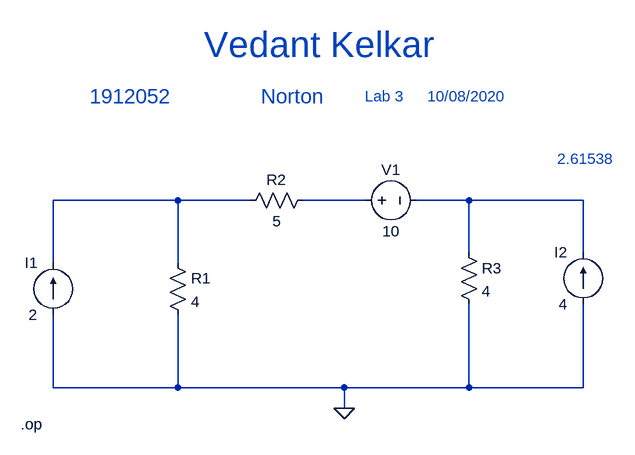
[diagram p0: schematic Draft6.asc]
Draft6.asc, the LTspice schematic file:
Version 4
SHEET 1 880 680
WIRE 96 -112 -96 -112
WIRE 208 -112 96 -112
WIRE 384 -112 288 -112
WIRE 544 -112 464 -112
WIRE 720 -112 544 -112
WIRE 544 -32 544 -112
WIRE 720 -32 720 -112
WIRE -96 -16 -96 -112
WIRE 96 -16 96 -112
WIRE -96 176 -96 64
WIRE 96 176 96 64
WIRE 96 176 -96 176
WIRE 352 176 96 176
WIRE 544 176 544 48
WIRE 544 176 352 176
WIRE 720 176 720 48
WIRE 720 176 544 176
WIRE 352 208 352 176
FLAG 352 208 0
SYMBOL current -96 64 R180
WINDOW 0 24 80 Left 2
WINDOW 3 24 0 Left 2
WINDOW 123 0 0 Left 0
WINDOW 39 0 0 Left 0
SYMATTR InstName I1
SYMATTR Value 2
SYMBOL res 80 -32 R0
SYMATTR InstName R1
SYMATTR Value 4
SYMBOL res 304 -128 R90
WINDOW 0 0 56 VBottom 2
WINDOW 3 32 56 VTop 2
SYMATTR InstName R2
SYMATTR Value 5
SYMBOL voltage 368 -112 R270
WINDOW 0 32 56 VTop 2
WINDOW 3 -32 56 VBottom 2
WINDOW 123 0 0 Left 0
WINDOW 39 0 0 Left 0
SYMATTR InstName V1
SYMATTR Value 10
SYMBOL res 528 -48 R0
SYMATTR InstName R3
SYMATTR Value 4
SYMBOL current 720 48 R180
WINDOW 0 24 80 Left 2
WINDOW 3 24 0 Left 2
WINDOW 123 0 0 Left 0
WINDOW 39 0 0 Left 0
SYMATTR InstName I2
SYMATTR Value 4
TEXT 136 -352 Left 5 ;Vedant Kelkar
TEXT -40 -272 Left 3 ;1912052
TEXT 224 -272 Left 3 ;Norton
TEXT 384 -272 Left 2 ;Lab 3
TEXT 480 -272 Left 2 ;10/08/2020
TEXT -146 232 Left 2 !.op
TEXT 680 -176 Left 2 ;2.61538

The netlist it stands for:
* Draft6.asc
I1 0 N001 2
R1 N001 0 4
R2 N002 N001 5
V1 N002 N003 10
R3 N003 0 4
I2 0 N003 4
* Vedant Kelkar
* 1912052
* Norton
* Lab 3
* 10/08/2020
.op
* 2.61538
.backanno
.end